# EAGLE schematic Startgate Controller (EAGLE 7.7.0)
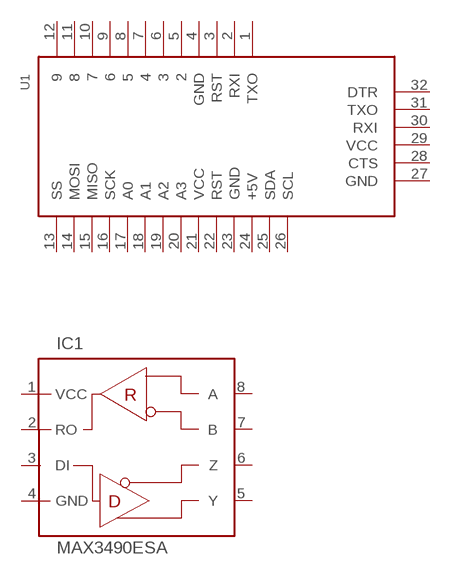
[diagram p0: schematic, sheet 1]

## Parts
IC1  MAX3490ESA  [SO08]
U1  ARDUINOPROMINI  [ARDUINOPROMINI]
Unconnected: IC1.2(RO) IC1.3(DI) IC1.5(Y) IC1.6(Z) IC1.7(B) IC1.8(A) U1.1(TXO) U1.2(RXI) U1.3(RST) U1.4(GND) U1.5 U1.6 U1.7 U1.8 U1.9 U1.10 U1.11 U1.12 U1.13(SS) U1.14(MOSI) U1.15(MISO) U1.16(SCK) U1.17(A0) U1.18(A1) U1.19(A2) U1.20(A3) U1.21(VCC) U1.22(RST) U1.23(GND) U1.25(SDA) U1.26(SCL) U1.27(GND) U1.28(CTS) U1.29(VCC) U1.30(RXI) U1.31(TXO) U1.32(DTR)

## Power pins joined to a net without a drawn wire
+5V: U1.24(+5V)
GND: IC1.4(GND)
VCC: IC1.1(VCC)

## Library data of the parts
IC1 = miro:MAX3490: +3.3V 10Mbps, RS-485 Transceivers
U1 = miro:ARDUINOPROMINI: Arduino Pro Mini - the compete module